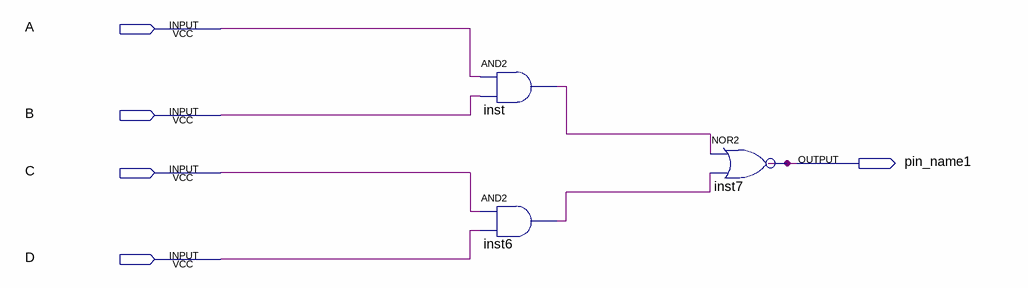
[diagram p0: schematic sheet]
// Quartus schematic simplecircuit.bdf as structural Verilog: 3 symbols, 5 pins
module simplecircuit (
  input  A,
  input  B,
  input  C,
  input  D,
  output pin_name1
);

  wire inst6_out, inst_out;

  and inst (inst_out, A, B);
  and inst6 (inst6_out, C, D);
  nor inst7 (pin_name1, inst_out, inst6_out);
endmodule
